# EAGLE design HixButton (EAGLE 9.6.2)
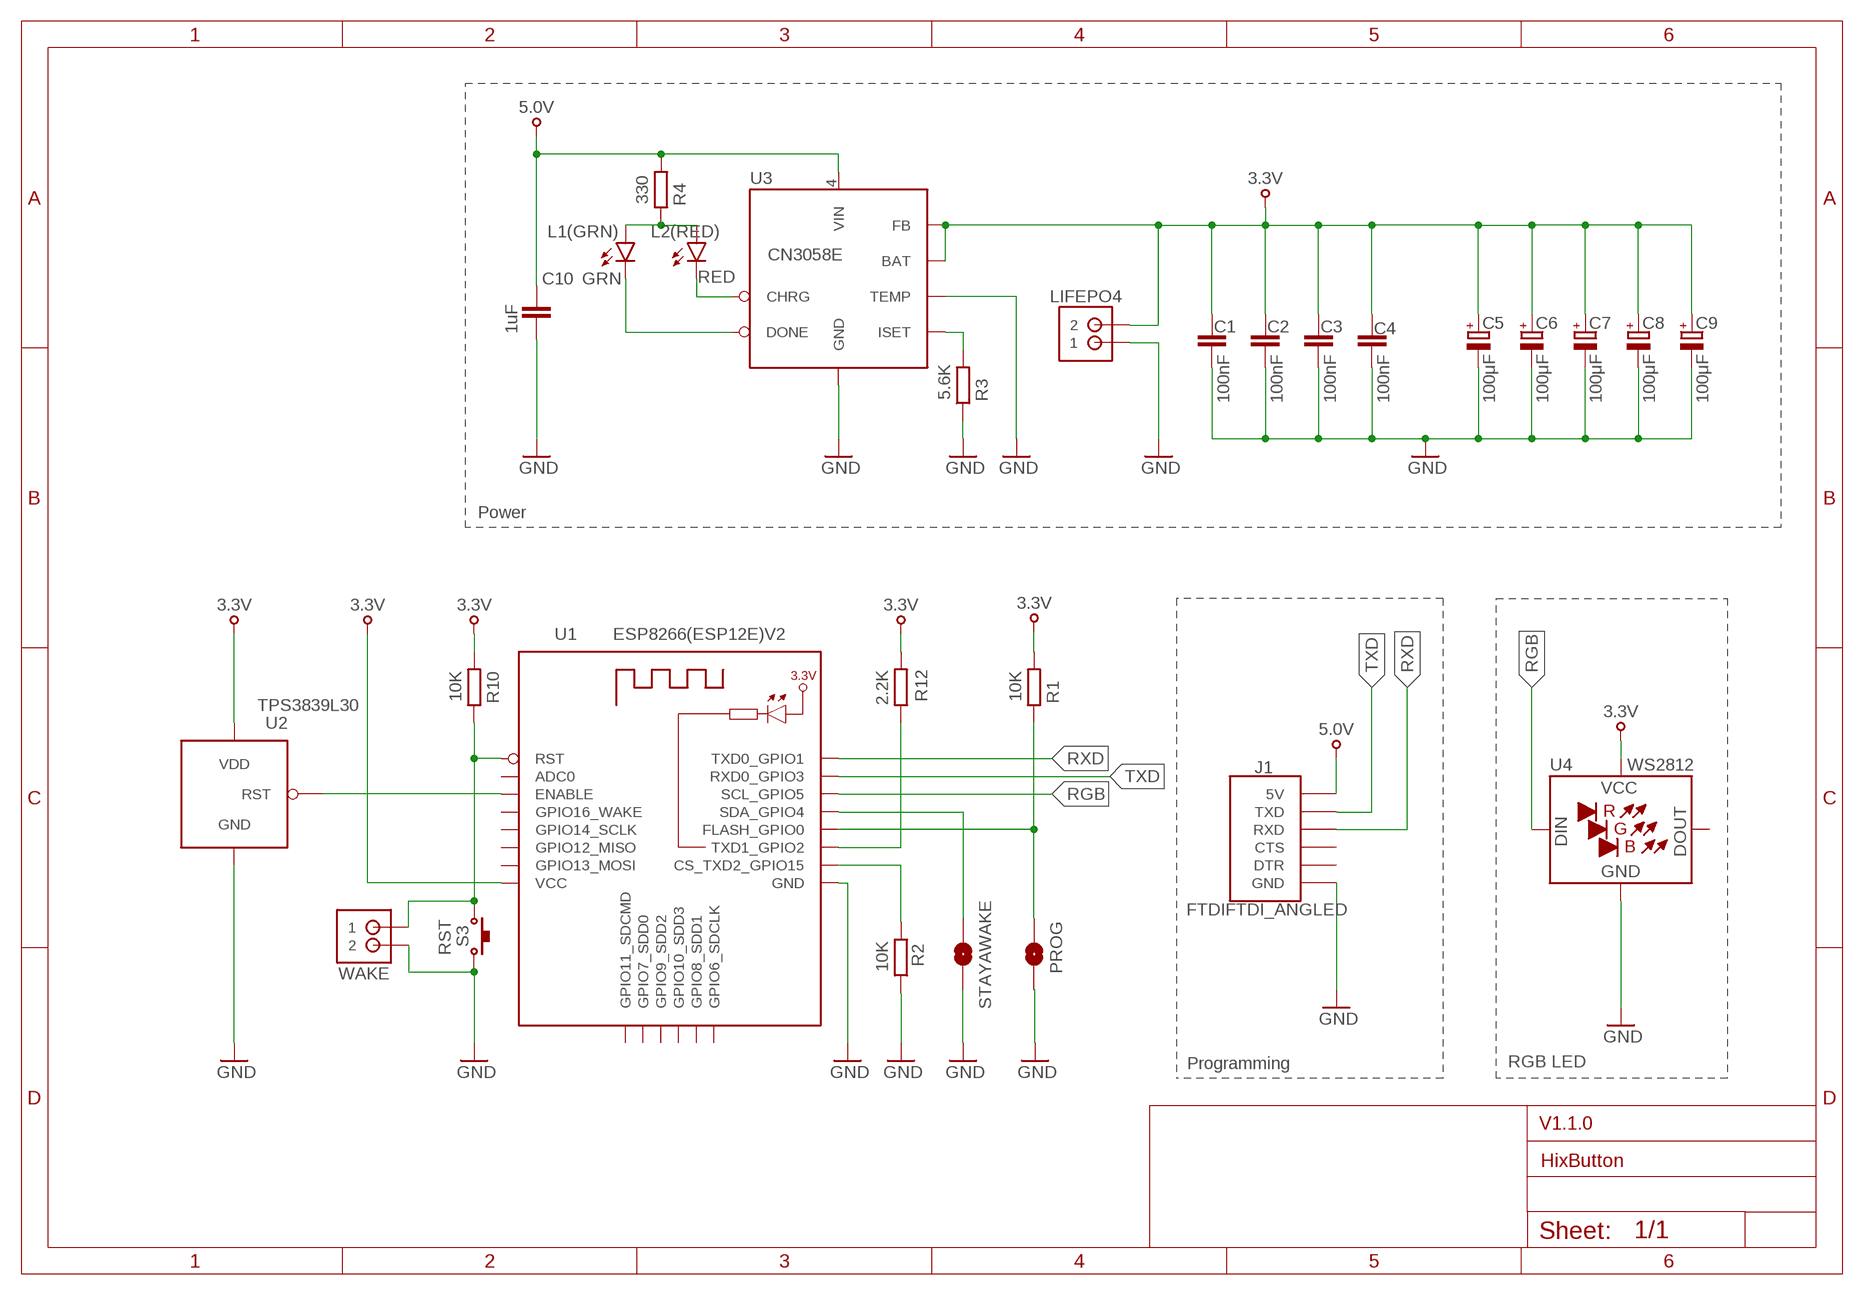
[diagram p0: schematic, sheet 1]

## Parts
C1  100nF  C-EUC1206  [C1206]
C2  100nF  C-EUC1206  [C1206]
C3  100nF  C-EUC1206  [C1206]
C4  100nF  C-EUC1206  [C1206]
C5  100μF  CPOL-EUSMCA  [SMC_A]
C6  100μF  CPOL-EUSMCA  [SMC_A]
C7  100μF  CPOL-EUSMCA  [SMC_A]
C8  100μF  CPOL-EUSMCA  [SMC_A]
C9  100μF  CPOL-EUSMCA  [SMC_A]
C10  1uF  C-EUC1206  [C1206]
J1  FTDIFTDI_ANGLED  [FTDI_ANGLED]
L1(GRN)  GRN  LEDCHIPLED_1206  [CHIPLED_1206]
L2(RED)  RED  LEDCHIPLED_1206  [CHIPLED_1206]
LIFEPO4  XH2P  [XH2P]
PROG  SJ  [SJ]
R1  10K  R-EU_R1206  [R1206]
R2  10K  R-EU_R1206  [R1206]
R3  5.6K  R-EU_R1206  [R1206]
R4  330  R-EU_R1206  [R1206]
R10  10K  R-EU_R1206  [R1206]
R12  2.2K  R-EU_R1206  [R1206]
S3  RST  PUSHBTNSMALL  [SMDPUSHBTN_TYPE1]
STAYAWAKE  SJ  [SJ]
U1  ESP8266(ESP12E)V2  [ESP8266(ESP12E)]
U2  TPS3839L30  TPS3839  [SOT23]
U3  CN3058E  [SOP8]
U4  WS2812  LED_RGBWS2812_5050  [LED_5050]
WAKE  XH2P  [XH2P]

## Nets
3.3V [power]: C1.1 C2.1 C3.1 C4.1 C5.+ C6.+ C7.+ C8.+ C9.+ LIFEPO4.2 R1.2 R10.2 R12.2 U1.VCC U2.3(VDD) U3.5(BAT) U3.8(FB) U4.3(VCC)
5.0V [power]: C10.1 J1.5V R4.2 U3.4(VIN)
GND [power]: C1.2 C2.2 C3.2 C4.2 C5.- C6.- C7.- C8.- C9.- C10.2 J1.GND LIFEPO4.1 PROG.1 R2.1 R3.1 S3.1 STAYAWAKE.1 U1.GND U2.1(GND) U3.1(TEMP) U3.3(GND) U4.1(GND) WAKE.2
N$1 [signal]: R2.2 U1.GPIO15_CS_TXD2(CS_TXD2_GPIO15)
N$2 [signal]: R12.1 U1.GPIO2_TXD1(TXD1_GPIO2)
N$3 [signal]: PROG.2 R1.1 U1.GPIO0_FLASH(FLASH_GPIO0)
N$4 [signal]: STAYAWAKE.2 U1.GPIO4_SDA(SDA_GPIO4)
N$5 [signal]: R10.1 S3.2 U1.RST WAKE.1
N$6 [signal]: R3.2 U3.2(ISET)
N$7 [signal]: U1.ENABLE U2.2(RST)
N$11 [signal]: L1(GRN).A L2(RED).A R4.1
N$12 [signal]: L2(RED).C U3.7(CHRG)
N$13 [signal]: L1(GRN).C U3.6(DONE)
RGB [signal]: U1.GPIO5_SCL(SCL_GPIO5) U4.2(DIN)
RXD [signal]: J1.RXD U1.GPIO1_TXD0(TXD0_GPIO1)
TXD [signal]: J1.TXD U1.GPIO3_RXD0(RXD0_GPIO3)
Unconnected: J1.CTS J1.DTR U1.ADC0 U1.CPIO11_SDCMD(GPIO11_SDCMD) U1.GPIO6_SDCLK U1.GPIO7_SDD0 U1.GPIO8_SDD1 U1.GPIO9_SDD2 U1.GPIO10_SDD3 U1.GPIO12_MISO U1.GPIO13_MOSI U1.GPIO14_SCLK U1.GPIO16_WAKE U4.4(DOUT)

## Notes on the sheet
- Power
- Programming | RGB LED
- V1.1.0

## Library data of the parts
C1-C4 C10 = rcl:C-EU: CAPACITOR, European symbol; SPICEPREFIX: C
C5-C9 = rcl:CPOL-EU: POLARIZED CAPACITOR, European symbol; SPICEPREFIX: C
J1 = 0_HixField:FTDI
L1(GRN) L2(RED) = led:LED: LED OSRAM: - CHIPLED LG R971, LG N971, LY N971, LG Q971, LY Q971, LO R971, LY R971 LH N974, LH R974 LS Q976, LO Q976, LY Q976 LO Q996 - Hyper CHIPLED LW Q18S LB Q993, LB Q99A, LB R99A - SideLED LS A670, LO A670, LY A670, LG A670, LP A670 LB A673, LV A673, LT A673, LW A673 LH A674 LY A675 LS A676, LA A676, LO A676, LY A676, LW A676 LS A679, LY A679, LG A679 - Hyper Micro SIDELED® LS Y876, LA Y876, LO Y876, LY Y876 LT Y87S - SmartLED LW L88C, LW L88S LB L89C, LB L89S, LG L890 LS L89K, LO L89K, LY L89K LS L896, LA L896, LO L896, LY L896 - TOPLED LS T670, LO T670, LY T670, LG T670, LP T670 LSG T670, LSP T670, LSY T670, LOP T670, LYG T670 LG T671, LOG T671, LSG T671 LB T673, LV T673, LT T673, LW T673 LH T674 LS T676, LA T676, LO T676, LY T676, LB T676, LH T676, LSB T676, LW T676 LB T67C, LV T67C, LT T67C, LS T67K, LO T67K, LY T67K, LW E67C LS E67B, LA E67B, LO E67B, LY E67B, LB E67C, LV E67C, LT E67C LW T67C LS T679, LY T679, LG T679 LS T770, LO T770, LY T770, LG T770, LP T770 LB T773, LV T773, LT T773, LW T773 LH T774 LS E675, LA E675, LY E675, LS T675 LS T776, LA T776, LO T776, LY T776, LB T776 LHGB T686 LT T68C, LB T68C - Hyper Mini TOPLED® LB M676 - Mini TOPLED Santana® LG M470 LS M47K, LO M47K, LY M47K Source: http://www.osram.convergy.de LUXEON: - LUMILED® LXK2-PW12-R00, LXK2-PW12-S00, LXK2-PW14-U00, LXK2-PW14-V00 LXK2-PM12-R00, LXK2-PM12-S00, LXK2-PM14-U00 LXK2-PE12-Q00, LXK2-PE12-R00, LXK2-PE12-S00, LXK2-PE14-T00, LXK2-PE14-U00 LXK2-PB12-K00, LXK2-PB12-L00, LXK2-PB12-M00, LXK2-PB14-N00, LXK2-PB14-P00, LXK2-PB14-Q00 LXK2-PR12-L00, LXK2-PR12-M00, LXK2-PR14-Q00, LXK2-PR14-R00 LXK2-PD12-Q00, LXK2-PD12-R00, LXK2-PD12-S00 LXK2-PH12-R00, LXK2-PH12-S00 LXK2-PL12-P00, LXK2-PL12-Q00, LXK2-PL12-R00 Source: www.luxeon.com KINGBRIGHT: KA-3528ASYC Source: www.kingbright.com
LIFEPO4 WAKE = 0_HixField:XH2P
PROG = 0_HixField:SJ: SMD solder JUMPER; SPICEPREFIX: B
R1-R4 R10 R12 = rcl:R-EU_: RESISTOR, European symbol; SPICEPREFIX: R
S3 = 0_HixField:PUSHBTN
STAYAWAKE = 0_HixField:SJ: SMD solder JUMPER
U1 = 0_HixField:ESP8266(ESP12E)V2
U2 = 0_HixField:TPS3839: P-Channel enchanced mode mosfet
U3 = 0_HixField:CN3058E
U4 = 0_HixField:LED_RGB

## Net classes
1 power: width 0.508 mm, drill 0.254 mm
2 signal: width 0.254 mm, drill 0.127 mm

## Board
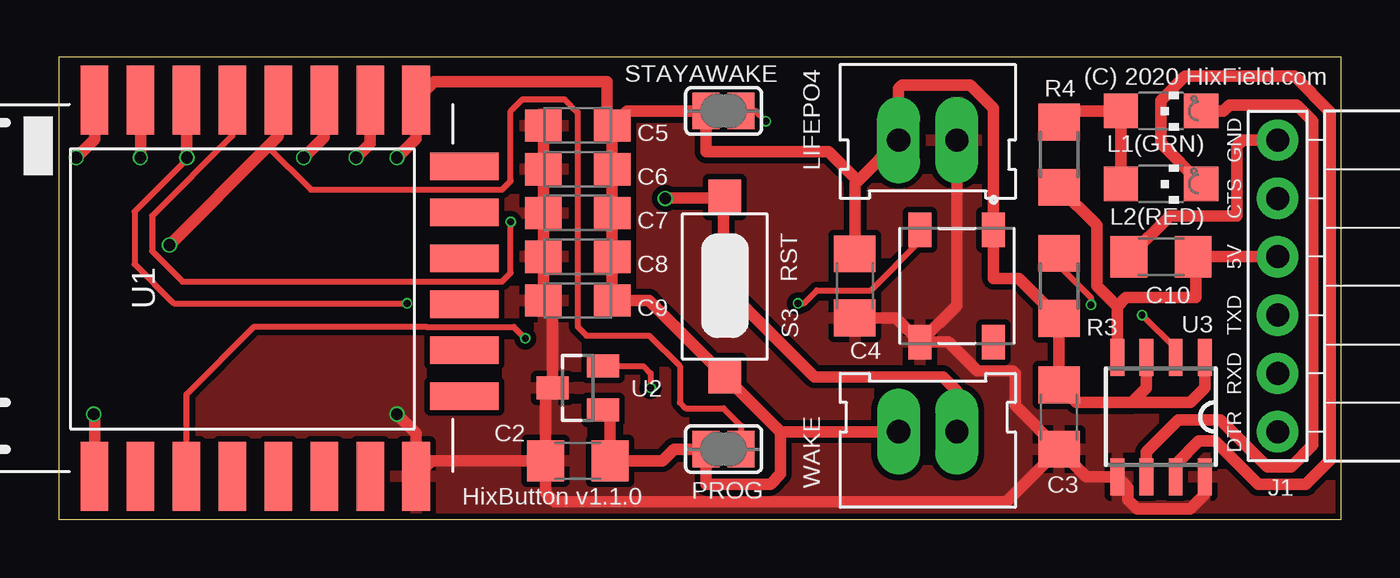
[diagram p1: board, top side]
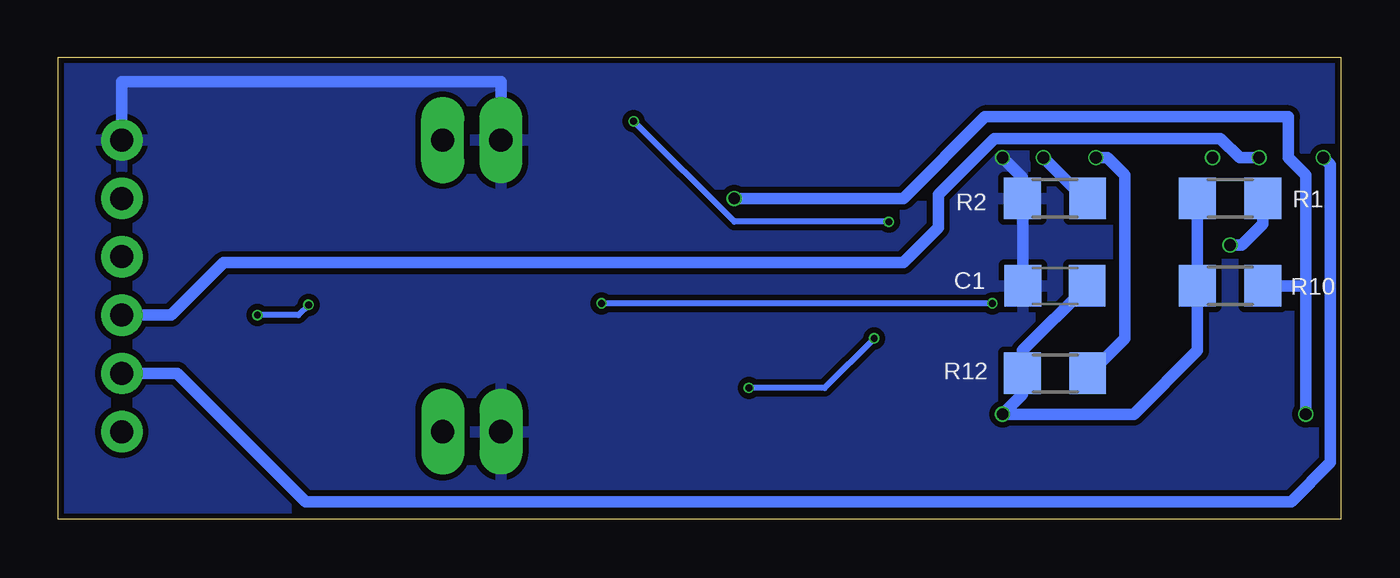
[diagram p2: board, bottom side, seen from below]

Size 55.86 x 20.12 mm. Coordinates in mm from the lower left corner, seen from the top.
Outline: 0,0 55.86,0 55.86,20.12 0,20.12 0,0
Copper layers (1*16): Top 0.035mm / dielectric 1.6mm / Bottom 0.035mm
Design rules "jlcpcb-2layers_more_margen": minimum track width 5mil, minimum drill 0.3mm, track to track 5mil, track to pad 10mil, pad to pad 10mil, via to via 10mil, smd to smd 5mil, copper to edge 0.2mm, drill to drill 6mil, minimum pad ring 10mil, minimum via ring 3mil, stop-mask expansion 4mil, vias tented up to drill 0mil, thermal gap 10mil

### Footprints (pad centres in the part's own frame; a part is rotated, then mirrored left to right if it is on the bottom)
C1206 = smd 1.6 x 1.8: 1 -1.4,0; 2 1.4,0
SMC_A = smd 1.6 x 1.4: + -1.5,0; - 1.5,0
FTDI_ANGLED = drill 1 pad 1.676: 5V 0,5.08; CTS 0,7.62; DTR 0,-2.54; GND 0,10.16; RXD 0,0; TXD 0,2.54
CHIPLED_1206 = smd 1.5 x 1.5: A 0,-1.75; C 0,1.75
XH2P = drill 1.016 pad 1.88 long: 1 0,2.54; 2 0,0
SJ = smd 1.168 x 1.6: 1 -0.762,0; 2 0.762,0
R1206 = smd 1.6 x 1.803: 1 -1.422,0; 2 1.422,0
SMDPUSHBTN_TYPE1 = smd 1.524 x 1.422: 1 -3.924,-0.051; 2 3.873,-0.051
ESP8266(ESP12E) = smd 3 x 1.2: ADC0 -8.3,3.8; ENABLE -8.3,1.8; GND 8.1,-8.2; GPIO0_FLASH 8.1,-2.2; GPIO1_TXD0 8.1,5.8; GPIO2_TXD1 8.1,-4.2; GPIO3_RXD0 8.1,3.8; GPIO4_SDA 8.1,-0.2; GPIO5_SCL 8.1,1.8; GPIO12_MISO -8.3,-4.2; GPIO13_MOSI -8.3,-6.2; GPIO14_SCLK -8.3,-2.2; GPIO15_CS_TXD2 8.1,-6.2; GPIO16_WAKE -8.3,-0.2; RST -8.3,5.8; VCC -8.3,-8.2 | smd 1.2 x 3: CPIO11_SDCMD -4.8,-10.3; GPIO6_SDCLK 5.2,-10.3; GPIO7_SDD0 -2.8,-10.3; GPIO8_SDD1 3.2,-10.3; GPIO9_SDD2 -0.8,-10.3; GPIO10_SDD3 1.2,-10.3
SOT23 = smd 1 x 1.4: 1 -0.95,-1.1; 2 0.95,-1.1; 3 0,1.1
SOP8 = smd 0.6 x 1.6: 1 -1.905,-2.6; 2 -0.635,-2.6; 3 0.635,-2.6; 4 1.905,-2.6; 5 1.905,2.6; 6 0.635,2.6; 7 -0.635,2.6; 8 -1.905,2.6
LED_5050 = smd 1.5 x 1: 1 -2.45,1.6; 2 -2.45,-1.6; 3 2.45,-1.6; 4 2.45,1.6

### Placement (x,y rotation side)
C1  12.45,10.16 180 bottom
C2  22.61,2.54 0 top
C3  43.56,4.45 90 top
C4  34.67,10.16 90 top
C5  22.61,17.15 0 top
C6  22.61,15.24 0 top
C7  22.61,13.34 0 top
C8  22.61,11.43 0 top
C9  22.61,9.52 0 top
C10  48.01,11.43 180 top
J1  53.09,6.35 0 top
L1(GRN)  48.01,17.78 270 top
L2(RED)  48.01,14.6 270 top
LIFEPO4  39.12,16.51 90 top
PROG  28.96,3.05 0 top
R1  4.83,13.97 180 bottom
R2  12.45,13.97 0 bottom
R3  43.56,10.16 90 top
R4  43.56,15.88 270 top
R10  4.83,10.16 180 bottom
R12  12.45,6.35 180 bottom
S3  28.96,10.16 90 top
STAYAWAKE  28.96,17.78 0 top
U1  7.37,10.16 90 top
U2  22.61,5.72 90 top
U3  48.01,4.45 180 top
U4  39.12,10.16 270 top
WAKE  36.58,3.81 270 top

### Tracks (layer width: path | path; a pad name or v marks a point on that pad's centre or on a via)
3.3V  (via drill 0.51)
  Top 0.508: C3.1 44.76,1.84 U3.5 46.56,1.38 46.56,0.84 46.94,0.45 49.28,0.45 49.91,1.09 U3.8 | C5.+ C6.+ C7.+ C8.+ C9.+ 21.51,9.13 U2.3 21.21,5.41 C2.1 | C4.1 36.47,8.76 U4.3 | C2.1 16.25,2.54 U1.VCC 15.57,3.74 v14.73,4.57 | C3.1 41.66,4.95 41.66,6.35 41.55,6.45 40.01,6.45 38.75,7.71 U4.3 | LIFEPO4.2 39.12,9.31 U4.3 | C2.1 21.21,1.15 21.59,0.76 41.28,0.76 C3.1
  Bottom 0.508: C1.1 13.87,7.34 R12.2 13.87,5.44 v14.73,4.57 9.02,4.57 6.25,7.34 R10.2 R1.2
  pour Top (isolate 0.25): -0.25,20.32 -0.25,0 55.63,0 55.63,20.32
5.0V
  Top 0.508: J1.5V C10.1 49.53,11.31 49.53,9.65 46.48,9.65 46.1,9.27 | U3.4 46.1,9.27 | 46.1,9.27 45.21,10.16 45.21,12.8 R4.2
GND  (via drill 0.51)
  Top 0.508: U3.3 47.37,5.72 46.74,5.08 | 46.74,5.08 44.33,5.08 C3.2 R3.1 41.81,10.49 40.72,10.49 U4.1 40.72,17.9 39.72,18.9 36.73,18.9 36.58,18.74 LIFEPO4.1 34.8,14.73 | U3.1 49.91,5.72 49.28,5.08 46.74,5.08 | C5.- C6.- C7.- C8.- C9.- 25.72,9.52 S3.1 31.43,3.81 | U2.1 24.01,4.47 C2.2 26.29,2.54 26.8,3.05 PROG.1 28.19,1.52 30.99,1.52 31.43,1.97 31.43,3.81 | 34.8,14.73 34.67,14.6 C4.2 | C5.- 23.88,17.38 23.88,19.05 16.36,19.05 U1.GND 15.57,16.58 v14.73,15.75 | C5.- 24.74,17.78 STAYAWAKE.1 28.19,16 33.53,16 34.8,14.73 | J1.GND 51.56,16.51 51.31,16.26 51.31,13.21 48.38,13.21 C10.2 | WAKE.2 31.43,3.81
  Bottom 0.508: C1.2 13.85,13.95 R2.1 13.87,14.88 v14.73,15.75 | J1.GND 53.09,19.05 36.58,19.05 LIFEPO4.1
  pour Bottom (isolate 0.25): -0.25,20.32 -0.25,0 55.63,0 55.63,20.32
N$1  (via drill 0.51)
  Top 0.508: U1.GPIO15_CS_TXD2 13.57,16.36 v12.95,15.75
  Bottom 0.508: v12.95,15.75 11.18,13.97 R2.2
N$2  (via drill 0.51)
  Top 0.508: U1.GPIO2_TXD1 11.57,16.65 v10.67,15.75
  Bottom 0.508: R12.1 10.92,6.35 9.4,7.87 9.4,14.99 10.16,15.75 v10.67,15.75
N$3  (via drill 0.51)
  Top 0.254: 9.11,16.22 10.99,14.35 19.3,14.35 19.68,14.73 19.68,17.78 20.19,18.29 22.03,18.29 22.61,17.72 22.61,8.38 22.99,8 25.72,8 27.05,6.67 27.05,5.08 27.31,4.83 28.96,4.83 29.72,4.06 PROG.2
  Top 0.508: U1.GPIO0_FLASH 9.57,16.68 9.11,16.22 v4.83,11.94
  Bottom 0.508: v4.83,11.94 4.32,11.94 3.4,12.85 R1.1
N$4  (via drill 0.3)
  Top 0.254: STAYAWAKE.2 30.35,17.78 v30.8,17.34 | v19.68,12.95 19.68,10.73 19.3,10.35 11.18,10.35 5.4,10.35 4.06,11.68 4.06,13.21 7.56,16.7 7.56,18.22 U1.GPIO4_SDA
  Bottom 0.254: v30.8,17.34 26.42,12.95 v19.68,12.95
N$5  (via drill 0.51)
  Top 0.508: v1.52,4.57 1.57,4.53 U1.RST | WAKE.1 39.12,5.59 38.51,6.2 32.92,6.2 28.96,10.16 28.96,13.98 | 28.96,13.98 S3.2 | v26.42,13.97 26.43,13.98 28.96,13.98
  Bottom 0.508: 1.52,10.16 v1.52,4.57 | 1.52,10.16 1.52,14.99 2.29,15.75 2.29,17.53 15.49,17.53 19.05,13.97 v26.42,13.97 | R10.1 1.52,10.16
N$6  (via drill 0.3)
  Top 0.254: U3.2 48.64,7.43 v47.18,8.89 | v44.96,9.33 44.96,9.65 43.56,11.05 R3.2
  Bottom 0.254: v47.18,8.89 45.4,8.89 v44.96,9.33
N$7  (via drill 0.3)
  Top 0.254: U1.ENABLE 5.57,5.44 8.51,8.38 16,8.38 16.01,8.38 19.82,8.38 v20.32,7.87 | U2.2 25.47,6.66 25.78,6.35 v25.78,5.72
  Bottom 0.254: v20.32,7.87 22.48,5.72 v25.78,5.72
N$11
  Top 0.508: L2(RED).A L1(GRN).A 44.04,17.78 R4.1
N$12
  Top 0.508: U3.7 48.64,2.39 49.66,3.41 50.35,3.41 52.24,1.51 54.31,1.51 55.38,2.58 55.38,17.74 53.83,19.29 49.05,19.29 47.99,18.23 47.99,16.37 L2(RED).C
N$13
  Top 0.508: L1(GRN).C 50.71,17.78 50.98,18.04 53.92,18.04 54.62,17.35 54.62,3.23 53.67,2.27 52.63,2.27 50.59,4.32 48.77,4.32 47.37,2.92 U3.6
RGB  (via drill 0.3, 0.51)
  Top 0.254: v32.2,9.4 32.45,9.4 33.02,9.97 35.37,9.97 37.47,12.07 37.47,12.57 U4.2 | v15.18,9.4 5.02,9.4 3.3,11.11 3.3,13.4 5.46,15.56 v5.59,15.75
  Top 0.508: U1.GPIO5_SCL 5.57,15.77 v5.59,15.75
  Bottom 0.254: v15.18,9.4 v32.2,9.4
RXD  (via drill 0.51)
  Top 0.508: U1.GPIO1_TXD0 1.57,16.55 v0.76,15.75
  Bottom 0.508: v0.76,15.75 0.45,15.44 0.45,2.47 2.16,0.76 45.08,0.76 50.67,6.35 J1.RXD
TXD  (via drill 0.51)
  Top 0.508: U1.GPIO3_RXD0 v3.57,15.76 v3.56,15.75
  Bottom 0.508: J1.TXD 50.93,8.89 48.64,11.18 19.05,11.18 17.53,12.7 17.53,14.14 15.08,16.59 5.24,16.59 4.4,15.75 v3.56,15.75

### Text on the board
tNames: (C) 2020 HixField.com | HixButton v1.1.0
tDocu: - | +